# Altium schematic sheet tms320f28388d_core_board_adc.SchDoc
size A3; SheetNumber: 2; SheetTotal: 5
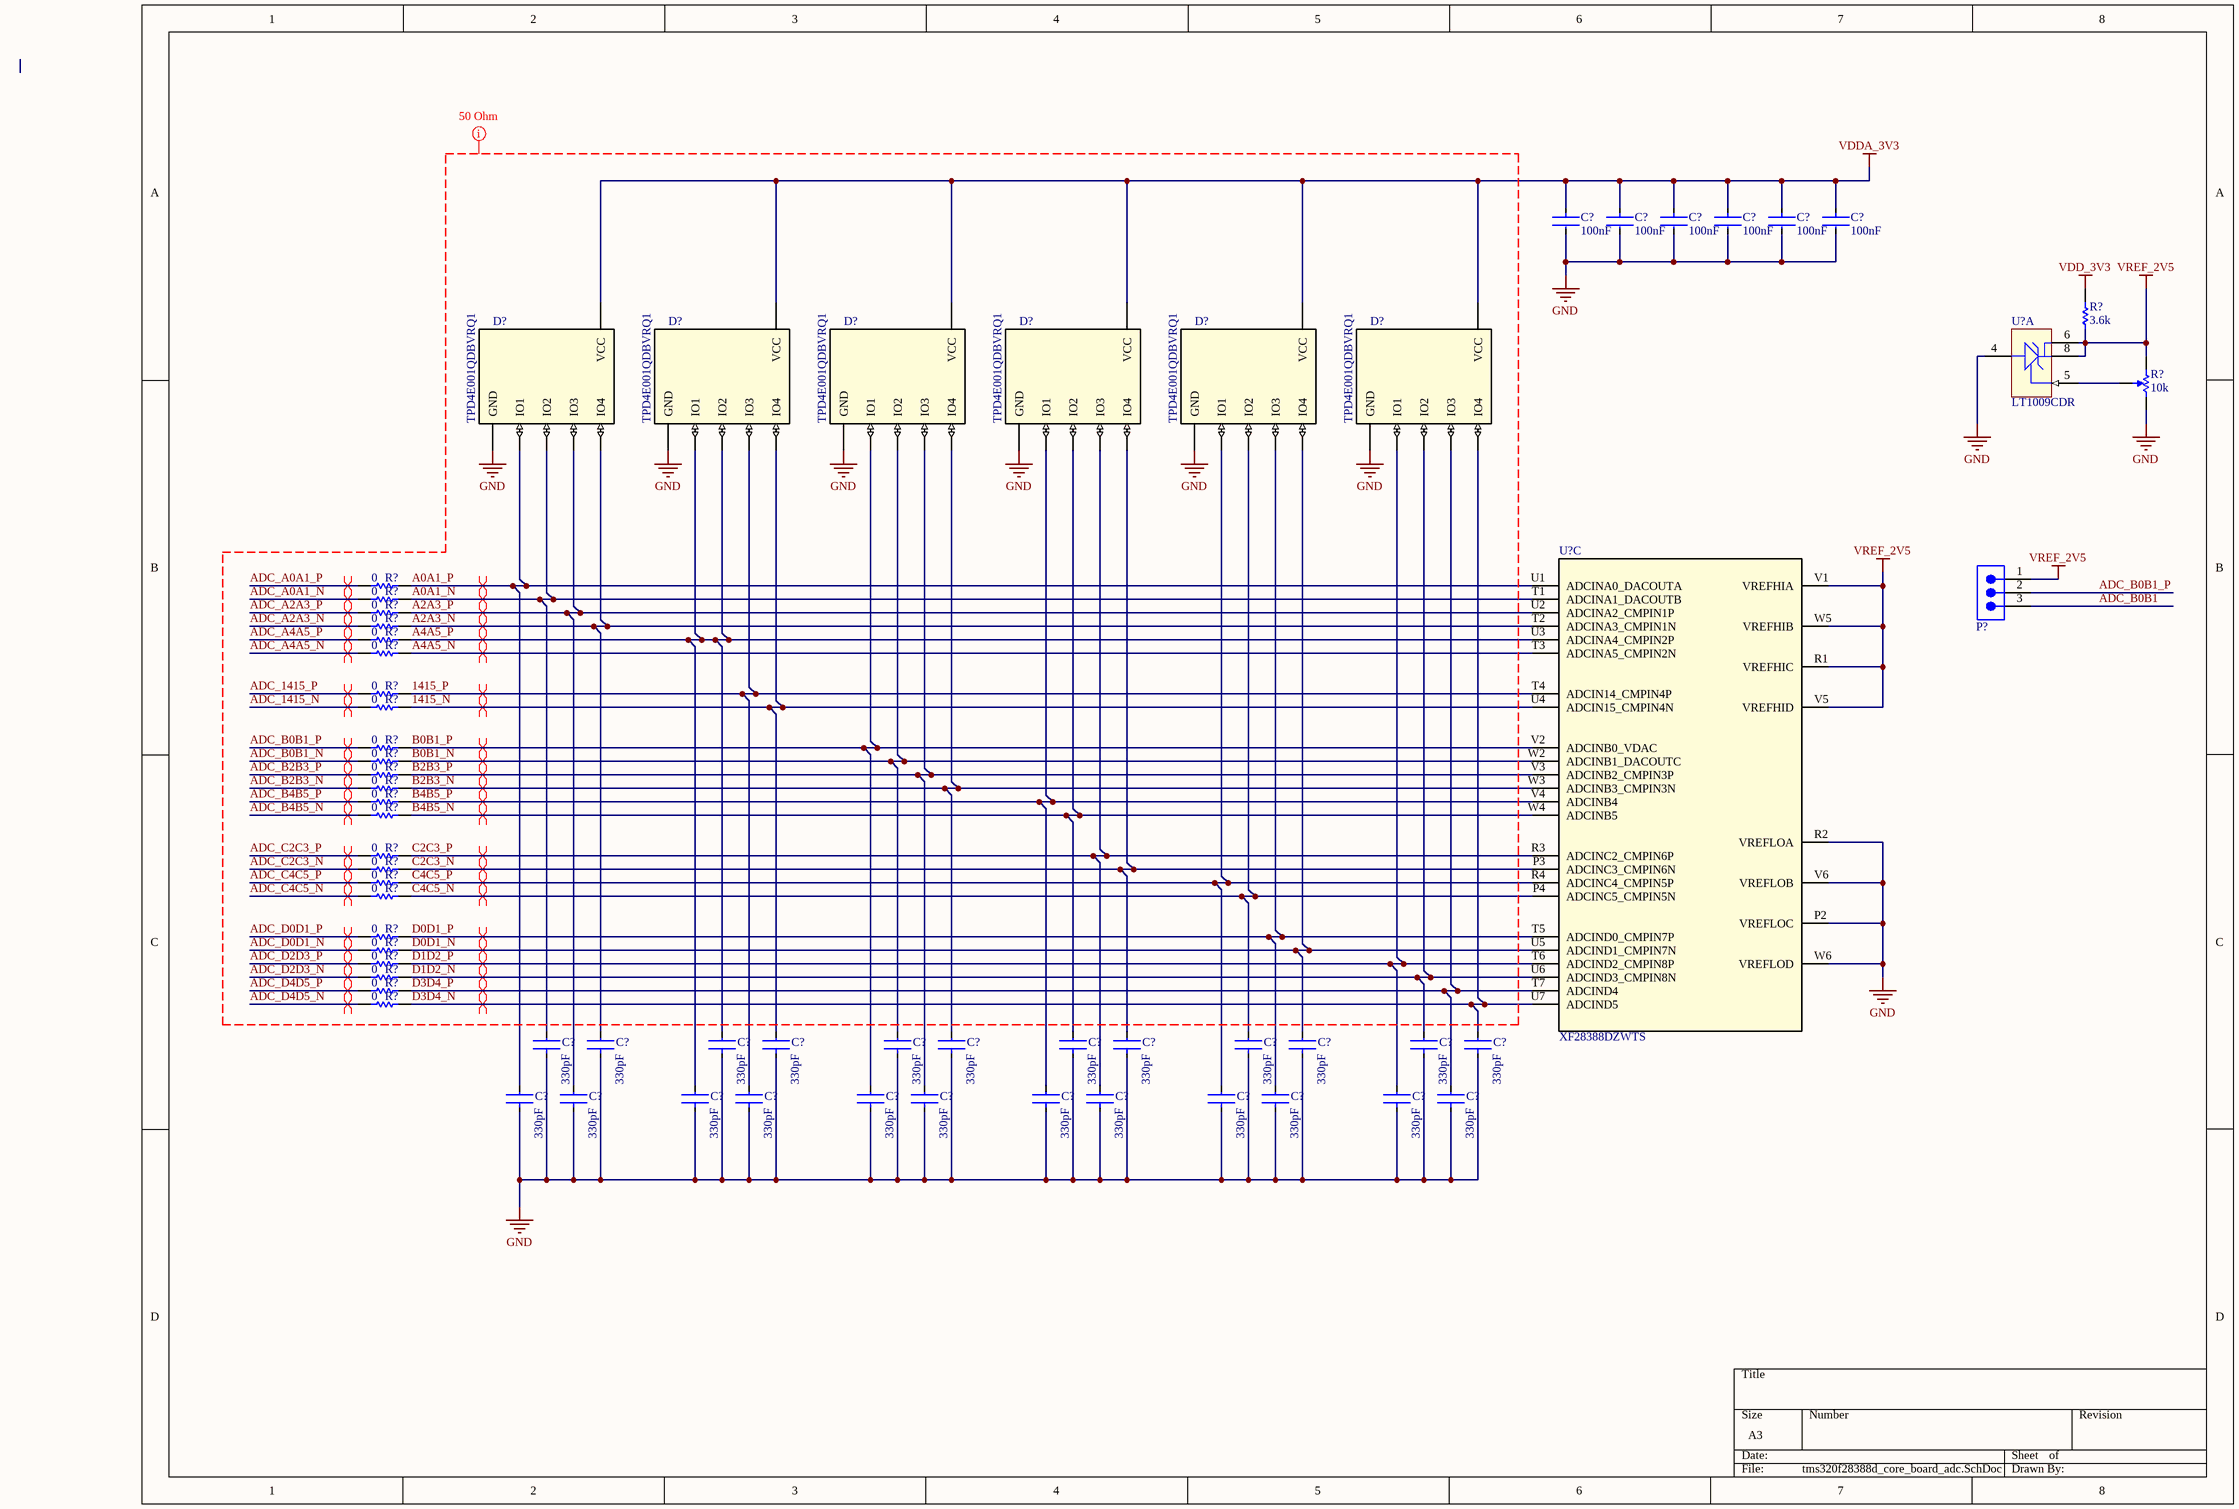
[diagram p0: tms320f28388d_core_board_adc.SchDoc]

## Parts
(Parts that share a designator on the sheet are numbered #1, #2 ... from top to bottom, then left to right.)
C?#1  100nF  [FP-CC0402-MFG]
C?#2  100nF  [FP-CC0402-MFG]
C?#3  100nF  [FP-CC0402-MFG]
C?#4  100nF  [FP-CC0402-MFG]
C?#5  100nF  [FP-CC0402-MFG]
C?#6  100nF  [FP-CC0402-MFG]
C?#7  330pF  [FP-GRM155-0_05-MFG]
C?#8  330pF  [FP-GRM155-0_05-MFG]
C?#9  330pF  [FP-GRM155-0_05-MFG]
C?#10  330pF  [FP-GRM155-0_05-MFG]
C?#11  330pF  [FP-GRM155-0_05-MFG]
C?#12  330pF  [FP-GRM155-0_05-MFG]
C?#13  330pF  [FP-GRM155-0_05-MFG]
C?#14  330pF  [FP-GRM155-0_05-MFG]
C?#15  330pF  [FP-GRM155-0_05-MFG]
C?#16  330pF  [FP-GRM155-0_05-MFG]
C?#17  330pF  [FP-GRM155-0_05-MFG]
C?#18  330pF  [FP-GRM155-0_05-MFG]
C?#19  330pF  [FP-GRM155-0_05-MFG]
C?#20  330pF  [FP-GRM155-0_05-MFG]
C?#21  330pF  [FP-GRM155-0_05-MFG]
C?#22  330pF  [FP-GRM155-0_05-MFG]
C?#23  330pF  [FP-GRM155-0_05-MFG]
C?#24  330pF  [FP-GRM155-0_05-MFG]
C?#25  330pF  [FP-GRM155-0_05-MFG]
C?#26  330pF  [FP-GRM155-0_05-MFG]
C?#27  330pF  [FP-GRM155-0_05-MFG]
C?#28  330pF  [FP-GRM155-0_05-MFG]
C?#29  330pF  [FP-GRM155-0_05-MFG]
C?#30  330pF  [FP-GRM155-0_05-MFG]
D?#1  TPD4E001QDBVRQ1  [FP-DBV0006A-MFG]
D?#2  TPD4E001QDBVRQ1  [FP-DBV0006A-MFG]
D?#3  TPD4E001QDBVRQ1  [FP-DBV0006A-MFG]
D?#4  TPD4E001QDBVRQ1  [FP-DBV0006A-MFG]
D?#5  TPD4E001QDBVRQ1  [FP-DBV0006A-MFG]
D?#6  TPD4E001QDBVRQ1  [FP-DBV0006A-MFG]
P?  TSW-103-07-G-S  [SMTC-TSW-103-07-X-S]  (value not drawn)
R?#1  3.6k  [RESC1005X40X25ML05T10]
R?#2  10k  [BOUR-TC33X-2_V]
R?#3  0  [FP-RC0402-0_4-MFG]
R?#4  0  [FP-RC0402-0_4-MFG]
R?#5  0  [FP-RC0402-0_4-MFG]
R?#6  0  [FP-RC0402-0_4-MFG]
R?#7  0  [FP-RC0402-0_4-MFG]
R?#8  0  [FP-RC0402-0_4-MFG]
R?#9  0  [FP-RC0402-0_4-MFG]
R?#10  0  [FP-RC0402-0_4-MFG]
R?#11  0  [FP-RC0402-0_4-MFG]
R?#12  0  [FP-RC0402-0_4-MFG]
R?#13  0  [FP-RC0402-0_4-MFG]
R?#14  0  [FP-RC0402-0_4-MFG]
R?#15  0  [FP-RC0402-0_4-MFG]
R?#16  0  [FP-RC0402-0_4-MFG]
R?#17  0  [FP-RC0402-0_4-MFG]
R?#18  0  [FP-RC0402-0_4-MFG]
R?#19  0  [FP-RC0402-0_4-MFG]
R?#20  0  [FP-RC0402-0_4-MFG]
R?#21  0  [FP-RC0402-0_4-MFG]
R?#22  0  [FP-RC0402-0_4-MFG]
R?#23  0  [FP-RC0402-0_4-MFG]
R?#24  0  [FP-RC0402-0_4-MFG]
R?#25  0  [FP-RC0402-0_4-MFG]
R?#26  0  [FP-RC0402-0_4-MFG]
U?#1  LT1009CDR  [D0008A_N]  (part A of 2)
U?#2  XF28388DZWTS  [ZWT0337A-MFG]  (part C of 8)

## Nets
GND: C?#1.2 C?#2.2 C?#3.2 C?#4.2 C?#5.2 C?#6.2 C?#7.1 C?#8.1 C?#9.1 C?#10.1 C?#11.1 C?#12.1 C?#13.1 C?#14.1 C?#15.1 C?#16.1 C?#17.1 C?#18.1 C?#19.1 C?#20.1 C?#21.1 C?#22.1 C?#23.1 C?#24.1 C?#25.1 C?#26.1 C?#27.1 C?#28.1 C?#29.1 C?#30.1 D?#1.2(GND) D?#2.2(GND) D?#3.2(GND) D?#4.2(GND) D?#5.2(GND) D?#6.2(GND) R?#2.3 U?#1.4(ANODE) U?#2.P2(VREFLOC) U?#2.R2(VREFLOA) U?#2.V6(VREFLOB) U?#2.W6(VREFLOD)
VDD_3V3: R?#1.2
VDDA_3V3: C?#1.1 C?#2.1 C?#3.1 C?#4.1 C?#5.1 C?#6.1 D?#1.5(VCC) D?#2.5(VCC) D?#3.5(VCC) D?#4.5(VCC) D?#5.5(VCC) D?#6.5(VCC)
VREF_2V5: P?.1 R?#1.1 R?#2.1 U?#1.6(CATHODE) U?#1.8(CATHODE) U?#2.R1(VREFHIC) U?#2.V1(VREFHIA) U?#2.V5(VREFHID) U?#2.W5(VREFHIB)
1415_N: C?#10.2 D?#2.6(IO4) R?#10.2 U?#2.U4(ADCIN15_CMPIN4N)
1415_P: C?#22.2 D?#2.4(IO3) R?#9.2 U?#2.T4(ADCIN14_CMPIN4P)
A0A1_N: C?#7.2 D?#1.3(IO2) R?#4.2 U?#2.T1(ADCINA1_DACOUTB)
A0A1_P: C?#19.2 D?#1.1(IO1) R?#3.2 U?#2.U1(ADCINA0_DACOUTA)
A2A3_N: C?#8.2 D?#1.6(IO4) R?#6.2 U?#2.T2(ADCINA3_CMPIN1N)
A2A3_P: C?#20.2 D?#1.4(IO3) R?#5.2 U?#2.U2(ADCINA2_CMPIN1P)
A4A5_N: R?#8.2 U?#2.T3(ADCINA5_CMPIN2N)
A4A5_P: C?#9.2 C?#21.2 D?#2.1(IO1) D?#2.3(IO2) R?#7.2 U?#2.U3(ADCINA4_CMPIN2P)
ADC_1415_N: R?#10.1
ADC_1415_P: R?#9.1
ADC_A0A1_N: R?#4.1
ADC_A0A1_P: R?#3.1
ADC_A2A3_N: R?#6.1
ADC_A2A3_P: R?#5.1
ADC_A4A5_N: R?#8.1
ADC_A4A5_P: R?#7.1
ADC_B0B1: P?.3
ADC_B0B1_N: R?#12.1
ADC_B0B1_P: P?.2 R?#11.1
ADC_B2B3_N: R?#14.1
ADC_B2B3_P: R?#13.1
ADC_B4B5_N: R?#16.1
ADC_B4B5_P: R?#15.1
ADC_C2C3_N: R?#18.1
ADC_C2C3_P: R?#17.1
ADC_C4C5_N: R?#20.1
ADC_C4C5_P: R?#19.1
ADC_D0D1_N: R?#22.1
ADC_D0D1_P: R?#21.1
ADC_D2D3_N: R?#24.1
ADC_D2D3_P: R?#23.1
ADC_D4D5_N: R?#26.1
ADC_D4D5_P: R?#25.1
B0B1_N: C?#11.2 D?#3.3(IO2) R?#12.2 U?#2.W2(ADCINB1_DACOUTC)
B0B1_P: C?#23.2 D?#3.1(IO1) R?#11.2 U?#2.V2(ADCINB0_VDAC)
B2B3_N: C?#12.2 D?#3.6(IO4) R?#14.2 U?#2.W3(ADCINB3_CMPIN3N)
B2B3_P: C?#24.2 D?#3.4(IO3) R?#13.2 U?#2.V3(ADCINB2_CMPIN3P)
B4B5_N: C?#13.2 D?#4.3(IO2) R?#16.2 U?#2.W4(ADCINB5)
B4B5_P: C?#25.2 D?#4.1(IO1) R?#15.2 U?#2.V4(ADCINB4)
C2C3_N: C?#14.2 D?#4.6(IO4) R?#18.2 U?#2.P3(ADCINC3_CMPIN6N)
C2C3_P: C?#26.2 D?#4.4(IO3) R?#17.2 U?#2.R3(ADCINC2_CMPIN6P)
C4C5_N: C?#15.2 D?#5.3(IO2) R?#20.2 U?#2.P4(ADCINC5_CMPIN5N)
C4C5_P: C?#27.2 D?#5.1(IO1) R?#19.2 U?#2.R4(ADCINC4_CMPIN5P)
D0D1_N: C?#16.2 D?#5.6(IO4) R?#22.2 U?#2.U5(ADCIND1_CMPIN7N)
D0D1_P: C?#28.2 D?#5.4(IO3) R?#21.2 U?#2.T5(ADCIND0_CMPIN7P)
D1D2_N: C?#17.2 D?#6.3(IO2) R?#24.2 U?#2.U6(ADCIND3_CMPIN8N)
D1D2_P: C?#29.2 D?#6.1(IO1) R?#23.2 U?#2.T6(ADCIND2_CMPIN8P)
D3D4_N: C?#18.2 D?#6.6(IO4) R?#26.2 U?#2.U7(ADCIND5)
D3D4_P: C?#30.2 D?#6.4(IO3) R?#25.2 U?#2.T7(ADCIND4)
NetR?#2_2: R?#2.2 U?#1.5(ADJ)

## Layout directives
differential pair: 1415_N, 1415_P, A0A1_N, A0A1_P, A2A3_N, A2A3_P, A4A5_N, A4A5_P, ADC_1415_N, ADC_1415_P, ADC_A0A1_N, ADC_A0A1_P, ADC_A2A3_N, ADC_A2A3_P, ADC_A4A5_N, ADC_A4A5_P, ADC_B0B1_N, ADC_B0B1_P, ADC_B2B3_N, ADC_B2B3_P, ADC_B4B5_N, ADC_B4B5_P, ADC_C2C3_N, ADC_C2C3_P, ADC_C4C5_N, ADC_C4C5_P, ADC_D0D1_N, ADC_D0D1_P, ADC_D2D3_N, ADC_D2D3_P, ADC_D4D5_N, ADC_D4D5_P, B0B1_N, B0B1_P, B2B3_N, B2B3_P, B4B5_N, B4B5_P, C2C3_N, C2C3_P, C4C5_N, C4C5_P, D0D1_N, D0D1_P, D1D2_N, D1D2_P, D3D4_N, D3D4_P
mark named 50 Ohm: 1415_N, 1415_P, A0A1_N, A0A1_P, A2A3_N, A2A3_P, A4A5_N, A4A5_P, ADC_1415_N, ADC_1415_P, ADC_A0A1_N, ADC_A0A1_P, ADC_A2A3_N, ADC_A2A3_P, ADC_A4A5_N, ADC_A4A5_P, ADC_B0B1_N, ADC_B0B1_P, ADC_B2B3_N, ADC_B2B3_P, ADC_B4B5_N, ADC_B4B5_P, ADC_C2C3_N, ADC_C2C3_P, ADC_C4C5_N, ADC_C4C5_P, ADC_D0D1_N, ADC_D0D1_P, ADC_D2D3_N, ADC_D2D3_P, ADC_D4D5_N, ADC_D4D5_P, B0B1_N, B0B1_P, B2B3_N, B2B3_P, B4B5_N, B4B5_P, C2C3_N, C2C3_P, C4C5_N, C4C5_P, D0D1_N, D0D1_P, D1D2_N, D1D2_P, D3D4_N, D3D4_P, GND

## Library data of the parts
C?#1-C?#6 = CC0402KRX7R7BB104: CAP CER 0.1UF 16V X7R 0402; Manufacturer: YAGEO; Material: Ceramic; Automotive Grade: NA; Temperature Coefficient: 30ppm/°C; Tolerance: 0.1; Device Class L1: Passive Components; Temperature Range Low: -55°C; Device Class L3: Ceramic Capacitors; Temperature Characteristic: X7R; Ipc Land Pattern Name: CAPC10050X50; Capacitance: 100 nF; Temperature Range High: +125°C; Voltage Rating: 16 V; Temperature: -55°C to +125°C; RoHS: TRUE; Automotive: No; Height: 0.55mm; Device Class L2: Capacitors; Digikey Description: CAP CER 0.1UF 16V X7R 0402; Package: CC0402; Footprint Url: http://www.yageo.com/exep/pages/download/literatures/UPY-C_GEN_24.pdf; ComponentLink2Description: Datasheet; Category: Cap; Lead Free: Yes; Value: 100 nF; Octopart: https://octopart.com/cc0402krx7r7bb104-yageo-42244624; ComponentLink2URL: http://www.yageo.com/documents/recent/UPY-GP_NP0_16V-to-50V_16.pdf; Manufacturer Part Number: CC0402KRX7R7BB104; Mouser Description: 0402 0.1 uF 16 V ±10 % Tolerance X7R SMT Multilayer Ceramic Capacitor
C?#7-C?#30 = GRM1555C1H331JA01D: Chip Multilayer Ceramic Capacitors for General Purpose, 0402, 330pF, C0G, 30ppm/°C, 5%, 50V; Insulation Resistance: 10GR; REACH SVHC: No SVHC; Depth: 0.5mm; Voltage Rating (DC): 50V; Number of Pins: 2; Max Operating Temperature: 125°C; Dielectric: C0G; Tolerance: 5%; Package Quantity: 1; Length: 1mm; Thickness: 0.022inch; Case/Package: 0402; Lead Free: Lead Free; Case Code (Imperial): 0402; Material: Ceramic; Voltage Rating: 50V; Voltage: 50V; Radiation Hardening: No; Min Operating Temperature: -55°C; Packaging: Tape and Reel; Capacitance: 330pF; Case Code (Metric): 1005; Width: 0.5mm; Mount: Surface Mount; Height: 0.5mm; Temperature Coefficient: 30ppm/°C; Termination: SMD/SMT
D?#1-D?#6 = TPD4E001QDBVRQ1: TVS DIODE 5.5V 16V SOT23-6; Power Line Protection: Yes; Breakdown Voltage: 11V; Peak Pulse Power: 100W; Number of Channels: 4; Peak Pulse Current: 5.5A; Current Rating: 1nA; Forward Voltage: 950mV; Direction: Unidirectional; Capacitance: 1.5pF; Leakage Current: 200nA; Interface: LVDS; Operating Supply Voltage: 5.5V; Number of Pins: 6; Lead Free: Lead Free; Max Operating Temperature: 125°C; Length: 3.05mm; RoHS Compliant: Yes; Reverse Standoff Voltage: 5.5V; Depth: 1.75mm; Mount: Surface Mount; Termination: SMD/SMT; Radiation Hardening: No; Min Breakdown Voltage: 11V; Max Power Dissipation: 100W; Clamping Voltage: 16V; Case/Package: SOT-23-6; Min Operating Temperature: -40°C; Packaging: Tape and Reel; Package Quantity: 3000; Working Voltage: 5.5V; Number of Bidirectional Channels: 4; Polarity: Unidirectional
P? = TSW-103-07-G-S: 0.025" SQ Post Header, Through-hole, Vertical, -55 to 125 degC, 2.54 mm Pitch, 3-Pin, Male, RoHS; Manufacturer: Samtec; Pitch: 2.54 mm; ComponentLink3URL: http://www.samtec.com/documents/webfiles/cpdf/TSW-XXX-XX-XXX-X-XX-XXX-MKT.pdf; Temperature Range: -55 to 125 degC; DatasheetVersion: F-214; ComponentLink1Description: Manufacturer URL; ComponentLink2URL: http://www.samtec.com/documents/webfiles/pdf/TSW_TH.PDF; RoHS: True; Orientation: Vertical; ComponentLink2Description: Datasheet; ComponentLink3Description: Package Specification; PackageDescription: .025[0.64] SQ. Post Terminal Strip Assembly; Mounting Technology: Through-hole; PackageVersion: DM, 8/1988; ComponentLink1URL: http://www.samtec.com; PackageReference: TSW-103-07-X-S; PartNumber: TSW-103-07-G-S
R?#1 = RC0402FR-073K6L: Manufacturer: Yageo / Phycomp; Part Number: RC0402FR-073K6L
R?#2 = TC33X-2-103E: Trimming Potentiometer, 10000 Ohm, -40 to 100 degC, 3-Pin SMD, RoHS, Tape and Reel; Manufacturer: Bourns; Tolerance: 25%; Max Power Dissipation: 100mW; Number of Turns: 1; Resistance: 10KOhm; Temperature Coefficient: 250ppm/degreesC; Voltage Rating (DC): 50V; Datasheet URL: http://www.bourns.com/docs/Product-Datasheets/TC33.pdf; Composition: Potentiometer; Package Description: 3-Pin Surface Mount Device, Body 3.8 x 3.6 mm; Weight: 29.4mg; Power Rating: 100mW; Termination: FootPrint; Manufacturer URL: http://www.bourns.com/; Width: 0.118inch; Height: 0.047inch; Military Standard: Not; Radiation Hardening: No; Colour: Silver; Case/Package: SMD/SMT; Depth: 3.8mm; Min Operating Temperature: -40degC; Lead Free: LeadFree; Datasheet Version: 42583.0; REACH SVHC: NoSVHC; Length: 3mm; RoHSCompliant: true; Contact Plating: Silver; Taper: Linear; Packaging: TapeandReel; Mount: SurfaceMount; Max Operating Temperature: 100degC; Package Reference: TC33X-2; Package Quantity: 2500
R?#3-R?#26 = RC0402FR-070RL: RES SMD 0 OHM JUMPER 1/16W 0402; Resistance: 0R; Temperature Coefficient: 200ppm/°C; Tolerance: 1%; Power Rating: 62.5mW; Voltage Rating: 50V; Max Power Dissipation: 63mW; Features: Moisture Resistant; Length: 1mm; Case Code (Metric): 1005; Series: RC; RoHS Compliant: Yes; Resistor Type: Thick Film; Height: 0.35mm; Min Operating Temperature: -55°C; Case Code (Imperial): 0402; Number of Terminations: 2; Contact Plating: Tin; Case/Package: 0402; Size Code: 0402; Termination: SMD/SMT; Max Operating Temperature: 155°C; Width: 0.5mm; Mount: Surface Mount; Lead Free: Lead Free; Packaging: Tape and Reel; Radiation Hardening: No
U?#1 = LT1009CDR: Integrated Reference Circuit, 2.5 V, 15 ppm / degC, 10 mA, 0 to 70 degC, 8-pin SOIC (D), Green (RoHS & no Sb/Br); Manufacturer: Texas Instruments; VO(V): 2.5; Initial Accuracy @ 25/deg C(%): 0.2; SubFamily: Shunt Voltage Reference; Temp Coeff(Typ)(ppm/ degree C): 15; Min Iz for Regulation(uA): 400; Rating: Catalog; Iout/Iz(Max)(mA): 10; Temp Coeff(Max)(ppm/ degree C): 25; ComponentLink3Description: Package Specification; ComponentLink1URL: http://www.ti.com/; ComponentLink2URL: http://www.ti.com/general/docs/lit/getliterature.tsp?genericPartNumber=LT1009&fileType=pdf; DatasheetVersion: SLVS013N; PackageDescription: 8-Pin Plastic Small Outline, Body 4.9 x 3.9 mm, Pitch 1.27 mm; ComponentLink1Description: Manufacturer URL; PackageReference: D0008A; ComponentLink2Description: Datasheet; PartNumber: LT1009CDR; Mounting Technology: Surface Mount; Eco-Plan: Green (RoHS & no Sb/Br); PackageVersion: 4040047-3/M; Code_JEDEC: MS-012; ComponentLink3URL: http://www.ti.com/litv/pdf/msoi002j
U?#2 = XF28388DZWTS: C2000 32-bit MCU w/ connectivity manager, 2x C28x+CLA CPU, 1.5 MB flash, FPU64, CLB, ENET, EtherCAT 337-NFBGA -40 to 125; Manufacturer_Name: Texas Instruments; TYPE: TYPE; RefDes: RefDes; Copyright: Copyright (C) 2026 Ultra Librarian. All rights reserved.; Manufacturer_Part_Number: XF28388DZWTS